# EAGLE design RPi_Extension_psu (EAGLE 7.6.0)
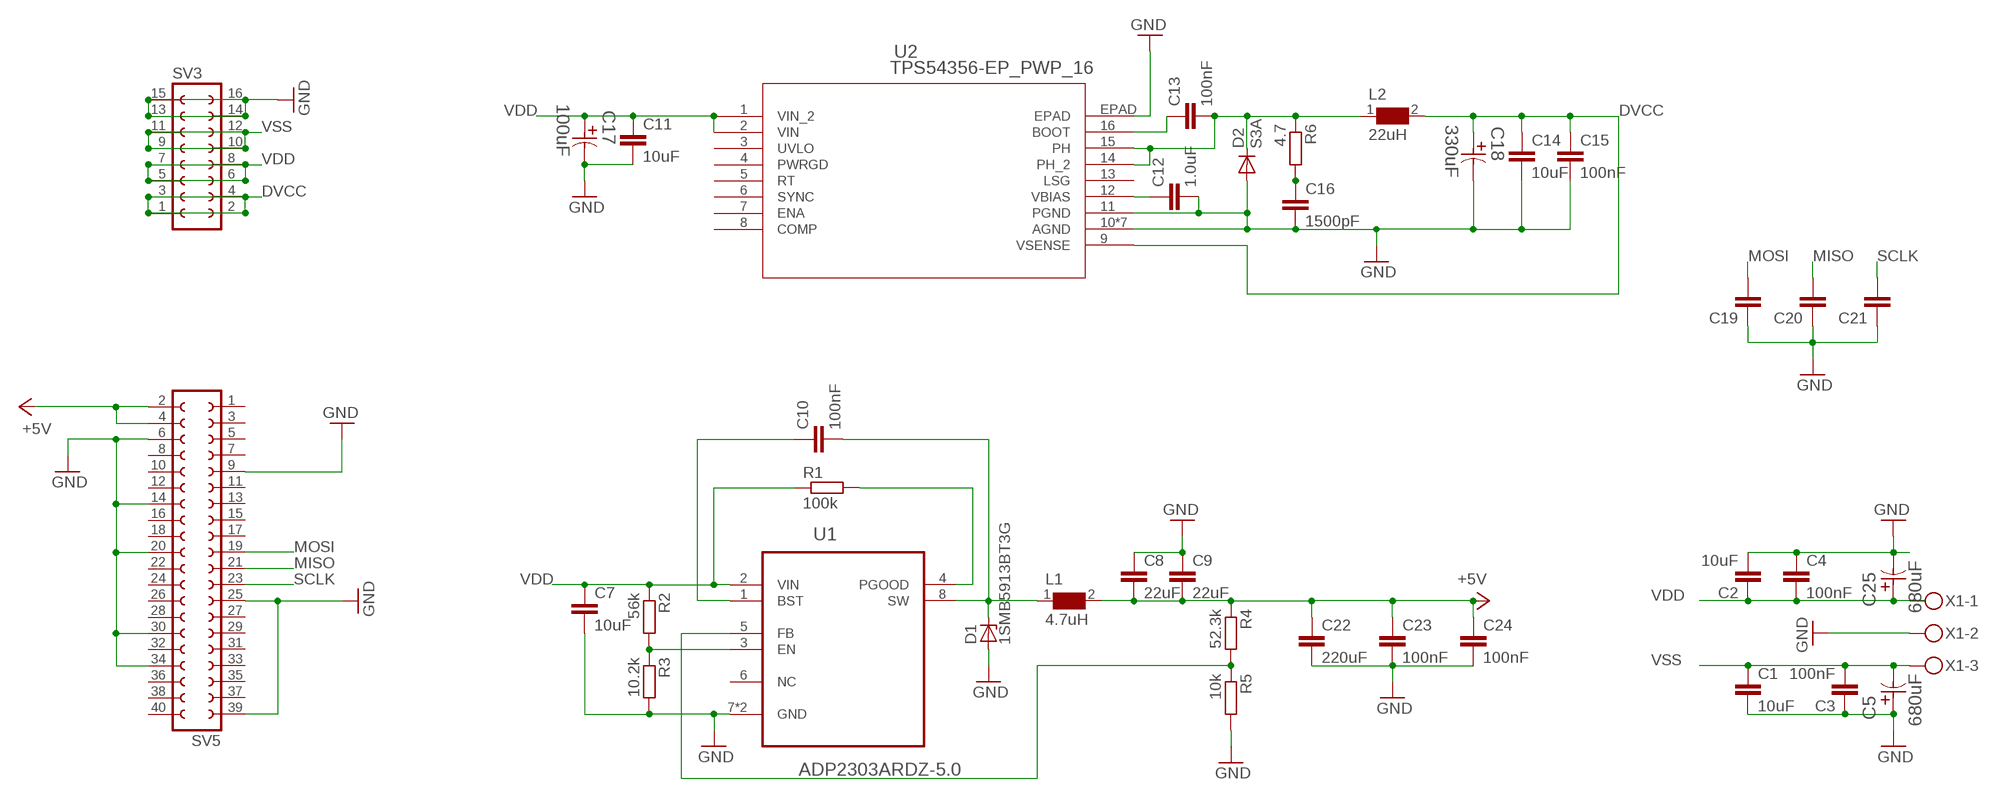
[diagram p0: schematic, sheet 1]

## Parts
C1  10uF  C-EUC1206  [C1206]
C2  10uF  C-EUC1206  [C1206]
C3  100nF  C-EUC0603  [C0603]
C4  100nF  C-EUC0603  [C0603]
C5  680uF  EEE-FT1C681AP-CASE-F  [CAPAE830X1050N]
C7  10uF  C-EUC0603  [C0603]
C8  22uF  C-EUC0603  [C0603]
C9  22uF  C-EUC0603  [C0603]
C10  100nF  C-EUC0603  [C0603]
C11  10uF  C-EUC0603  [C0603]
C12  1.0uF  C-EUC0603  [C0603]
C13  100nF  C-EUC0603  [C0603]
C14  10uF  C-EUC0603  [C0603]
C15  100nF  C-EUC0603  [C0603]
C16  1500pF  C-EUC0603  [C0603]
C17  100uF  EEE-FK1V101XP-CASE-D8  [CAPAE660X800N]
C18  330uF  EEE-FK1V331P-CASE-G  [CAPAE1030X1050N]
C19  C-EUC0603  [C0603]
C20  C-EUC0603  [C0603]
C21  C-EUC0603  [C0603]
C22  220uF  C-EUC1206  [C1206]
C23  100nF  C-EUC0603  [C0603]
C24  100nF  C-EUC0603  [C0603]
C25  680uF  EEE-FT1C681AP-CASE-F  [CAPAE830X1050N]
D1  1SMB5913BT3G  [DO214AA]
D2  S3A  [DO214AB]
L1  4.7uH  WE-PD-7447713047_1030/1050  [WE-PD_1030/1050]
L2  22uH  WE-PD-744770122_1260/1245/1280/1210  [WE-PD_1260/1245/1280/1210]
R1  100k  R-EU_R0603  [R0603]
R2  56k  R-EU_R0603  [R0603]
R3  10.2k  R-EU_R0603  [R0603]
R4  52.3k  R-EU_R0603  [R0603]
R5  10k  R-EU_R0603  [R0603]
R6  4.7  R-EU_R0603  [R0603]
SV3  FE08-2  [FE08-2]
SV5  FE20-2  [FE20-2]
U1  ADP2303ARDZ-5.0  [SOIC127P600X175-9N]
U2  TPS54356-EP_PWP_16  [PWP16_2P31X2P46]
X1  MKDSN1,5/3-5,08  [MKDSN1,5/3-5,08]

## Nets
+5V: C8.2 C9.2 C22.1 C23.1 C24.1 L1.2 R4.1 SV5.2 SV5.4
DVCC: C14.1 C15.1 C18.1 L2.2 SV3.1 SV3.2 SV3.3 SV3.4 U2.9(VSENSE)
GND: C1.2 C2.2 C3.1 C4.1 C5.1 C7.2 C8.1 C9.1 C11.2 C12.2 C14.2 C15.2 C16.2 C17.2 C18.2 C19.1 C20.1 C21.1 C22.2 C23.2 C24.2 C25.2 D1.A D2.A R3.2 R5.2 SV3.13 SV3.14 SV3.15 SV3.16 SV5.6 SV5.9 SV5.14 SV5.20 SV5.25 SV5.30 SV5.34 SV5.39 U1.7(GND) U1.9(GND) U2.10(AGND) U2.11(PGND) U2.EPAD U2.V(AGND) U2.V_1(AGND) U2.V_2(AGND) U2.V_3(AGND) U2.V_4(AGND) U2.V_5(AGND) X1.2
MISO: C20.2 SV5.21
MOSI: C19.2 SV5.19
N$1: R1.2 U1.4(PGOOD)
N$2: C10.1 U1.1(BST)
N$3: R2.2 R3.1 U1.3(EN)
N$4: C10.2 D1.C L1.1 U1.8(SW)
N$5: R4.2 R5.1 U1.5(FB)
N$6: C13.1 U2.16(BOOT)
N$7: C12.1 U2.12(VBIAS)
N$9: C16.1 R6.2
SCLK: C21.2 SV5.23
VDD: C2.1 C4.2 C7.1 C11.1 C17.1 C25.1 R1.1 R2.1 SV3.5 SV3.6 SV3.7 SV3.8 U1.2(VIN) U2.1(VIN_2) U2.2(VIN) X1.1
VOUT: C13.2 D2.C L2.1 R6.1 U2.14(PH_2) U2.15(PH)
VSS: C1.1 C3.2 C5.2 SV3.9 SV3.10 SV3.11 SV3.12 X1.3
Unconnected: SV5.1 SV5.3 SV5.5 SV5.7 SV5.8 SV5.10 SV5.11 SV5.12 SV5.13 SV5.15 SV5.16 SV5.17 SV5.18 SV5.22 SV5.24 SV5.26 SV5.27 SV5.28 SV5.29 SV5.31 SV5.32 SV5.33 SV5.35 SV5.36 SV5.37 SV5.38 SV5.40 U1.6(NC) U2.3(UVLO) U2.5(RT) U2.6(SYNC) U2.7(ENA) U2.8(COMP) U2.13(LSG)

## Power pins joined to a net without a drawn wire
PWRGD: U2.4(PWRGD)

## Library data of the parts
C1-C4 C7-C16 C19-C21 C23 C24 = rcl:C-EU: CAPACITOR, European symbol
C5 C25 = Panasonic-EEEFT_EEEH:EEE-: Aluminum Electrolytic Capacitors,Surface Mount Type; MPN: EEE-FT1C681AP; OC_FARNELL: 2065973; OC_NEWARK: 73T9162; PACKAGE: CASE-F; SUPPLIER: PANASONIC; TOLERANCE: ±20 %; VALUE: 680UF; VOLTAGERATING: 16V
C17 = Panasonic-EEEFK_EEEFP:EEE-: Aluminum Electrolytic Capacitors,Surface Mount Type; MPN: EEE-FK1V101XP; OC_FARNELL: 1850114; OC_NEWARK: 23T0869; PACKAGE: CASE-D8; SUPPLIER: PANASONIC; TOLERANCE: ±20 %; VALUE: 100UF; VOLTAGERATING: 35V
C18 = Panasonic-EEEFK_EEEFP:EEE-: Aluminum Electrolytic Capacitors,Surface Mount Type; MPN: EEE-FK1V331P; OC_FARNELL: 9695885; OC_NEWARK: 80K7175; PACKAGE: CASE-G; SUPPLIER: PANASONIC; TOLERANCE: ±20 %; VALUE: 330UF; VOLTAGERATING: 35V
C22 = resistor:C-EU: CAPACITOR, European symbol
D1 = 1smb59xx_10:1SMB59*BT3G: 1SMB59xxBT3G Series 3 Watt Plastic Surface Mount Zener Voltage Regulators Source: http://www.onsemi.com/pub_link/Collateral/1SMB5913BT3-D.PDF; MF: ON Semiconductor; MPN: 1SMB5913BT3G; OC_FARNELL: 1431155; OC_NEWARK: 88H5165
D2 = s3x_10:S3*: S3A - S3N General Purpose Rectifiers Source: http://www.fairchildsemi.com/datasheets/S3/S3A.pdf; MF: Fairchild; MPN: S3A; OC_FARNELL: 1017803; OC_NEWARK: 58K2395
L1 = WE-PD:WE-PD: SMD-Shielded Power Inductors WE-PD - Magnetically shielded version which results in a low leakage field - High storage capacity - Low self-losses - Highest possible current loading for SMD-Inducors -- Switching regulators with low operating voltages (computer, laptop, mobile phones, pagers) -- Integrated DC/DC-converter -- Is recommended for the application with switching regulators from National Semiconductor, Linear Technology, Texas Instruments and Fairchild Semiconductor, ect. -- Graphic cards -- Plastic base: Because of the one piece construction these are more suitable for high vibration or shock applications; MPN: 7447713047; OC_FARNELL: 2082661; OC_NEWARK: 88T7091; PACKAGE: 1030; SUPPLIER: Wuerth Elektronik
L2 = WE-PD:WE-PD: SMD-Shielded Power Inductors WE-PD - Magnetically shielded version which results in a low leakage field - High storage capacity - Low self-losses - Highest possible current loading for SMD-Inducors -- Switching regulators with low operating voltages (computer, laptop, mobile phones, pagers) -- Integrated DC/DC-converter -- Is recommended for the application with switching regulators from National Semiconductor, Linear Technology, Texas Instruments and Fairchild Semiconductor, ect. -- Graphic cards -- Plastic base: Because of the one piece construction these are more suitable for high vibration or shock applications; MPN: 744770122; OC_FARNELL: 1635927; OC_NEWARK: 08P2756; PACKAGE: 1280; SUPPLIER: Wuerth Elektronik
R1-R6 = rcl:R-EU_: RESISTOR, European symbol
SV3 = con-lsta:FE08-2: FEMALE HEADER; OC_FARNELL: unknown; OC_NEWARK: unknown
SV5 = con-lsta:FE20-2: FEMALE HEADER; OC_FARNELL: unknown; OC_NEWARK: unknown
U1 = ADP2303ARDZ:ADP2303ARDZ-5.0: Step-Down Regulators; MPN: ADP2303ARDZ-5.0; OC_FARNELL: 1843645; OC_NEWARK: 12T1264; PACKAGE: SOIC-8; SUPPLIER: Analog Devices
U2 = TPS54356:TPS54356-EP_PWP_16; DATASHEETURL: http://www.ti.com/lit/gpn/TPS54356-EP; DESCRIPTION: Enhanced Product 4.5-V To 20-V Input, 3-A Output Synchronous Pwm Switches W/ Integrated Fet; FAMILY_NAME: STEP-DOWN REGULATOR; GENERIC_PART_NUMBER: TPS54356-EP; INDUSTRY_STD_PKG_TYPE: HTSSOP; MANUFACTURER: Texas Instruments; MANUFACTURER_PART_NUMBER: tps54356-ep_pwp_16; PACKAGE_DESIGNATOR: PWP; PIN_COUNT: 16; VENDOR: Texas Instruments
X1 = con-phoenix-508:MKDSN1,5/3-5,08: MKDSN 1,5/ 3-5,08 Printklemme Nennstrom: 13,5 A Nennspannung: 250 V Rastermaß: 5,08 mm Polzahl: 3 Anschlussart: Schraubanschluss Montage: Löten Anschlussrichtung Leiter/Platine: 0 ° Artikelnummer: 1729131 Source: http://eshop.phoenixcontact.com .. 1729131.pdf

## Board
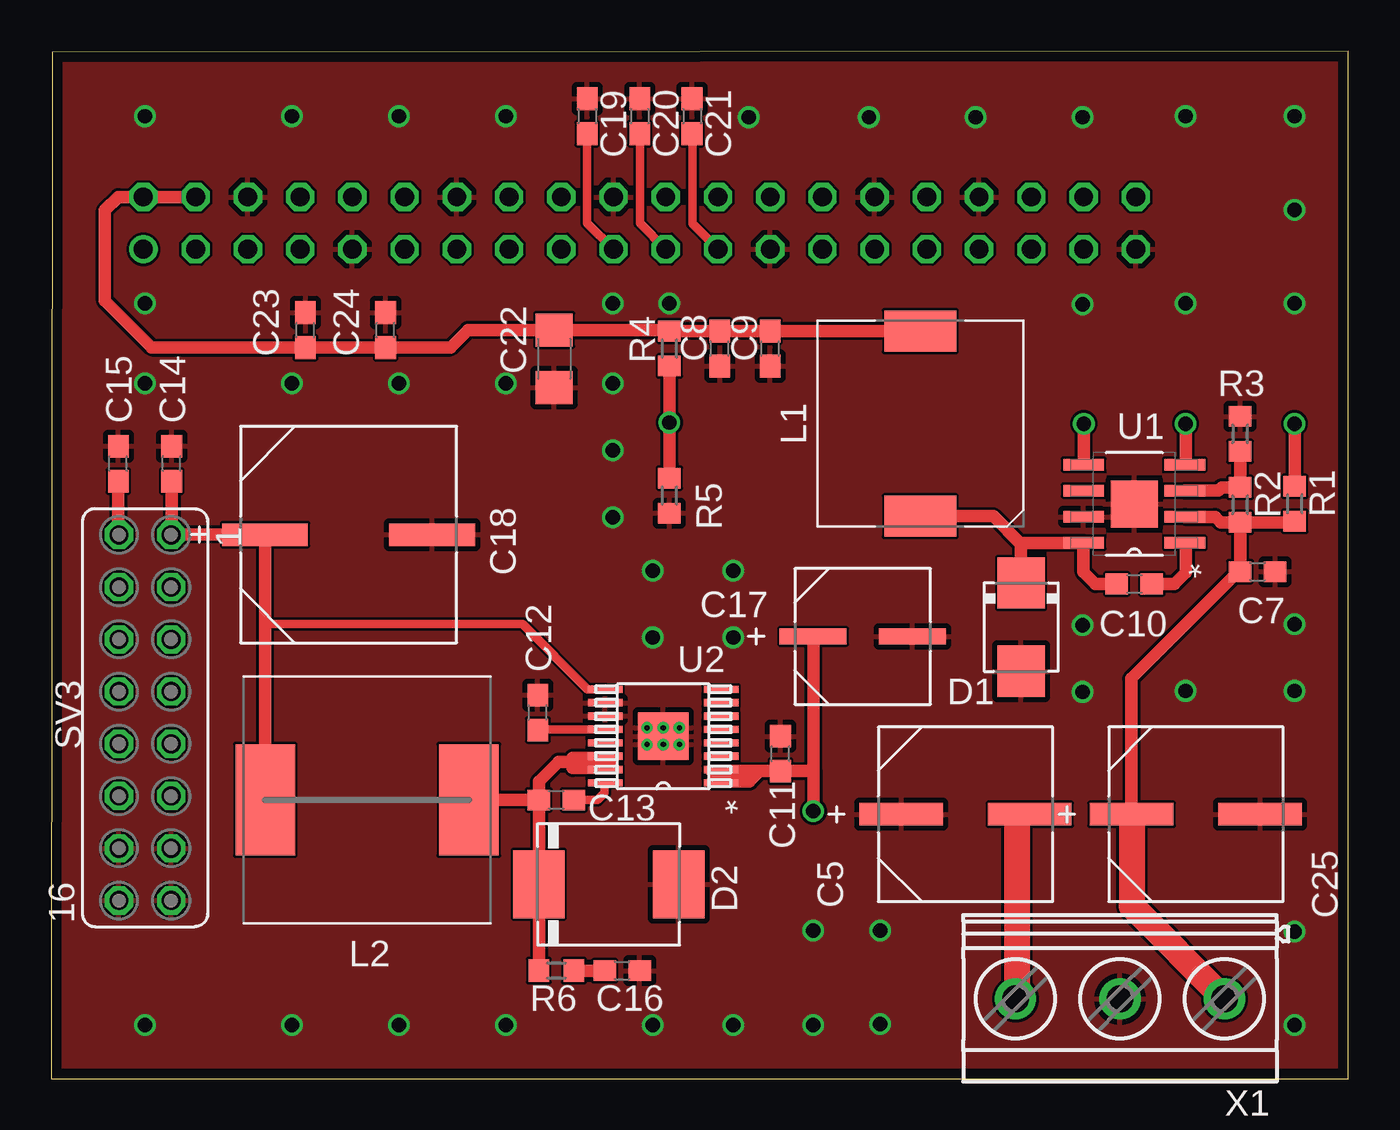
[diagram p1: board, top side]
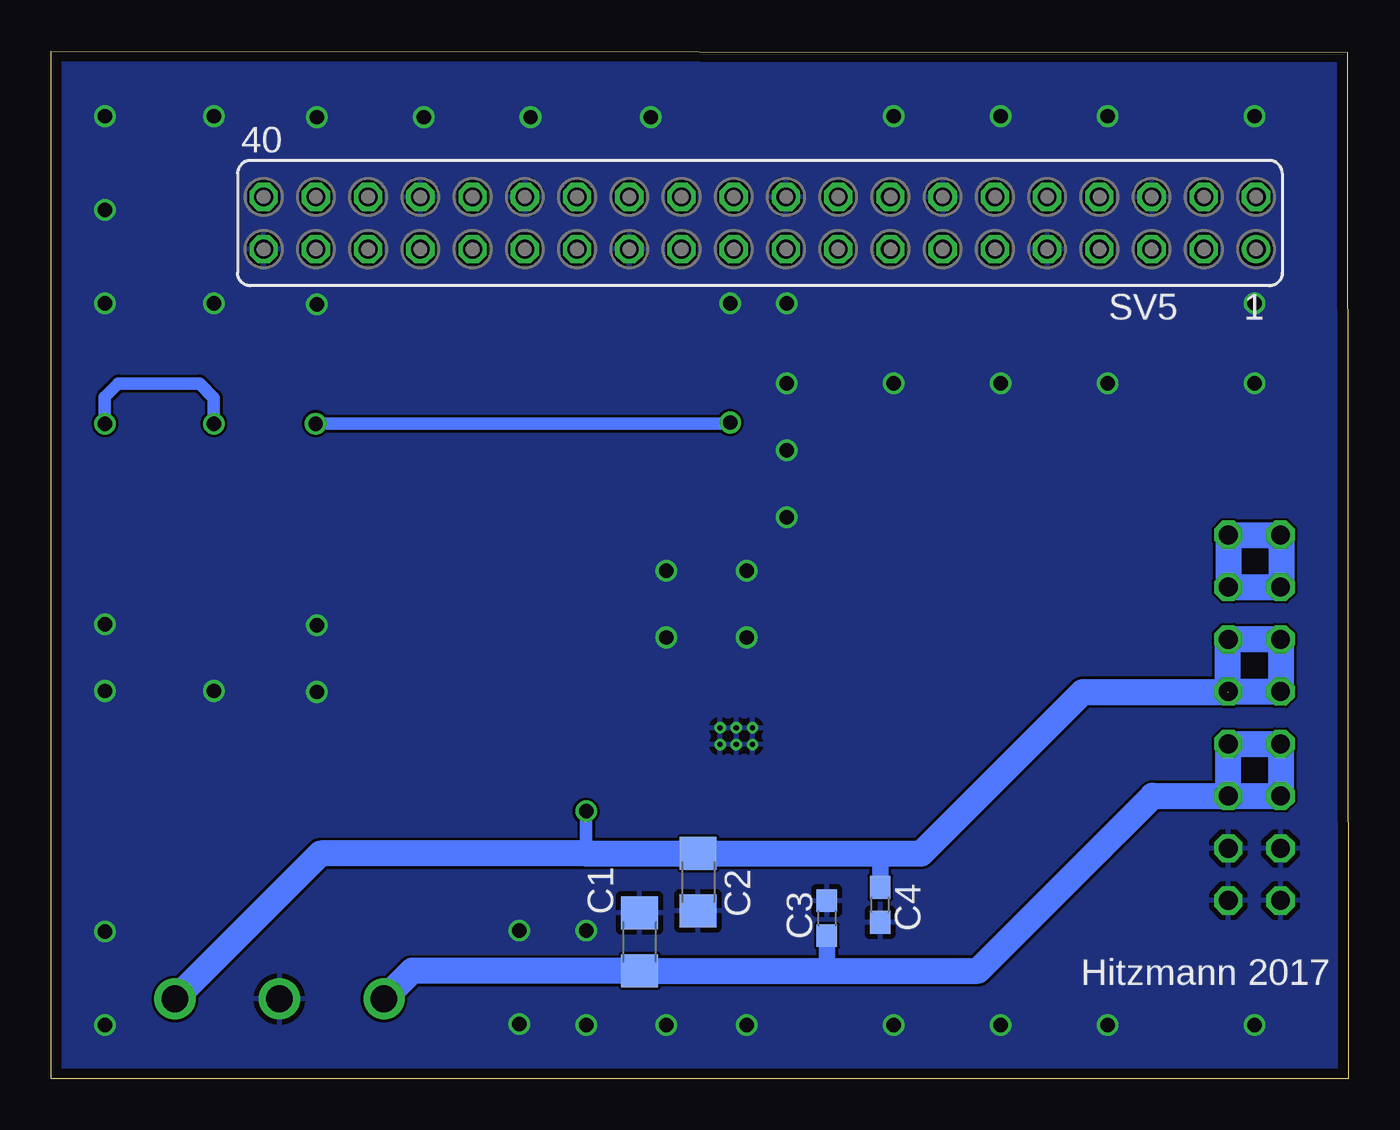
[diagram p2: board, bottom side, seen from below]

Size 63.05 x 49.95 mm. Coordinates in mm from the lower left corner, seen from the top.
Outline: 0,0 63.05,0 63.05,49.95 0.05,49.9 0,0
Copper layers (1*16): Top 0.035mm / dielectric 1.53mm / Bottom 0.035mm
Design rules "pban_5mil-l2": minimum track width 5mil, minimum drill 0.3mm, track to track 5mil, track to pad 0.229mm, pad to pad 5mil, via to via 5mil, smd to smd 5mil, copper to edge 0.5mm, drill to drill 0.5mm, minimum pad ring 0.15mm, minimum via ring 0.15mm, stop-mask expansion 4mil, vias tented up to drill 0.35mm, thermal gap 10mil

### Footprints (pad centres in the part's own frame; a part is rotated, then mirrored left to right if it is on the bottom)
C1206 = smd 1.6 x 1.8: 1 -1.4,0; 2 1.4,0
C0603 = smd 1.1 x 1: 1 -0.85,0; 2 0.85,0
CAPAE830X1050N = smd 4.064 x 1.092: 1 -3.124,0; 2 3.124,0
CAPAE660X800N = smd 3.251 x 0.762: 1 -2.413,0; 2 2.413,0
CAPAE1030X1050N = smd 4.166 x 1.092: 1 -4.064,0; 2 4.064,0
DO214AA = smd 2.5 x 2.3: A 2.15,0; C -2.15,0
DO214AB = smd 2.5 x 3.3: A 3.4,0; C -3.4,0
WE-PD_1030/1050 = smd 2 x 3.5: 1 -4.5,0; 2 4.5,0
WE-PD_1260/1245/1280/1210 = smd 2.9 x 5.4: 1 -4.95,0; 2 4.95,0
R0603 = smd 1 x 1.1: 1 -0.85,0; 2 0.85,0
FE08-2 = drill 0.914 octagon: 1 -8.89,1.27; 2 -8.89,-1.27; 3 -6.35,1.27; 4 -6.35,-1.27; 5 -3.81,1.27; 6 -3.81,-1.27; 7 -1.27,1.27; 8 -1.27,-1.27; 9 1.27,1.27; 10 1.27,-1.27; 11 3.81,1.27; 12 3.81,-1.27; 13 6.35,1.27; 14 6.35,-1.27; 15 8.89,1.27; 16 8.89,-1.27
FE20-2 = drill 0.914: 1 -24.13,1.27 | drill 0.914 octagon: 2 -24.13,-1.27; 3 -21.59,1.27; 4 -21.59,-1.27; 5 -19.05,1.27; 6 -19.05,-1.27; 7 -16.51,1.27; 8 -16.51,-1.27; 9 -13.97,1.27; 10 -13.97,-1.27; 11 -11.43,1.27; 12 -11.43,-1.27; 13 -8.89,1.27; 14 -8.89,-1.27; 15 -6.35,1.27; 16 -6.35,-1.27; 17 -3.81,1.27; 18 -3.81,-1.27; 19 -1.27,1.27; 20 -1.27,-1.27; 21 1.27,1.27; 22 1.27,-1.27; 23 3.81,1.27; 24 3.81,-1.27; 25 6.35,1.27; 26 6.35,-1.27; 27 8.89,1.27; 28 8.89,-1.27; 29 11.43,1.27; 30 11.43,-1.27; 31 13.97,1.27; 32 13.97,-1.27; 33 16.51,1.27; 34 16.51,-1.27; 35 19.05,1.27; 36 19.05,-1.27; 37 21.59,1.27; 38 21.59,-1.27; 39 24.13,1.27; 40 24.13,-1.27
SOIC127P600X175-9N = smd 1.981 x 0.559: 1 -2.464,1.905; 2 -2.464,0.635; 3 -2.464,-0.635; 4 -2.464,-1.905; 5 2.464,-1.905; 6 2.464,-0.635; 7 2.464,0.635; 8 2.464,1.905 | smd 2.286 x 2.286: 9 0,0
PWP16_2P31X2P46 = smd 1.676 x 0.356: 1 -2.819,2.275; 2 -2.819,1.625; 3 -2.819,0.975; 4 -2.819,0.325; 5 -2.819,-0.325; 6 -2.819,-0.975; 7 -2.819,-1.625; 8 -2.819,-2.275; 9 2.819,-2.275; 10 2.819,-1.625; 11 2.819,-0.975; 12 2.819,-0.325; 13 2.819,0.325; 14 2.819,0.975; 15 2.819,1.625; 16 2.819,2.275 | smd 2.46 x 2.31: EPAD 0,0 | drill 0.254 pad 0.508: V -0.787,-0.406; V_1 -0.787,0.406; V_2 0,-0.406; V_3 0,0.406; V_4 0.787,-0.406; V_5 0.787,0.406
MKDSN1,5/3-5,08 = drill 1.3 pad 2: 1 -7.641,0.025; 2 -2.561,0.025; 3 2.519,0.025

### Placement (x,y rotation side)
C1  34.45,6.65 90 bottom
C2  31.6,9.55 270 bottom
C3  25.35,7.8 270 bottom
C4  22.75,8.45 90 bottom
C5  44.45,12.85 0 top
C7  58.65,24.65 0 top
C8  47uF  [C0603]  32.5,35.5 90 top
C9  100nF  [C0603]  34.95,35.5 90 top
C10  52.65,24.05 180 top
C11  35.45,15.8 90 top
C12  23.65,17.8 90 top
C13  24.55,13.55 180 top
C14  5.85,29.9 90 top
C15  3.25,29.9 90 top
C16  27.75,5.25 0 top
C17  39.45,21.5 0 top
C18  14.45,26.45 0 top
C19  26.05,46.8 270 top
C20  28.6,46.8 270 top
C21  31.15,46.8 270 top
C22  24.45,35 270 top
C23  12.35,36.4 90 top
C24  16.25,36.4 90 top
C25  55.65,12.85 0 top
D1  47.15,21.95 270 top
D2  27.1,9.45 0 top
L1  42.25,31.85 90 top
L2  15.35,13.55 180 top
R1  60.45,27.95 90 top
R2  57.8,27.9 90 top
R3  57.8,31.35 90 top
R4  30.05,35.5 270 top
R5  30.05,28.35 270 top
R6  24.55,5.25 0 top
SV3  4.55,17.55 270 top
SV5  28.6,41.6 180 bottom
U1  52.65,27.95 180 top
U2  29.75,16.65 180 top
X1  MKDSN1,5/3-5,08  [MKDSN1,5/3-5,08]  49.4,3.9 180 top

### Tracks (layer width: path | path; a pad name or v marks a point on that pad's centre or on a via)
+5V
  Top 0.61: SV5.4 SV5.2 3.25,42.87 2.6,42.22 2.6,37.83 4.88,35.55 C23.1 C24.1 19.4,35.55 20.25,36.4 C22.1 30,36.4 R4.1 | L1.2 C9.2 C8.2 R4.1 | R4.1 29.95,36.35 29.9,36.4
DVCC
  Top 0.406: 10.4,22.1 22.9,22.1 26.07,18.93 U2.9
  Top 0.61: L2.2 10.4,22.1 10.4,26.44 C18.1 SV3.1 5.85,26.47 C14.1 | C15.1 3.25,26.47 SV3.2
  Bottom 0.406: SV3.2 SV3.1
  Bottom 1.27: SV3.4 SV3.3 SV3.1 3.25,26.44 3.25,24.05
GND  (via drill 0.7)
  other vias: 30.05,37.7 4.55,37.7 4.55,33.8 37.05,7.2 29.25,2.6 37.05,2.6 55.15,37.7 55.15,18.85 60.45,37.7 60.45,2.6 11.7,2.6 4.55,46.8 55.15,46.8 60.45,46.8 60.45,18.85 27.3,30.55 27.3,27.3 27.3,33.8 50.15,37.65 50.15,18.8 50.15,22.05 60.45,22.1 16.9,2.6 11.7,46.8 50.15,46.75 44.95,46.75 39.75,46.75 16.9,46.8 22.1,46.8 60.45,42.25 27.3,37.7 29.25,24.7 29.25,21.45 11.7,33.8 16.9,33.8 22.1,33.8 60.45,7.15 4.55,2.6 22.1,2.6 33.15,24.7 33.15,21.45 33.9,46.75 40.3,7.2 40.3,2.65 33.15,2.6
  pour Top: -0.65,-0.65 63.7,-0.65 63.7,50.7 -0.65,50.7
  pour Bottom: 0,0 0,50.05 63.05,50.05 63.05,0
MISO
  Top 0.406: SV5.21 28.61,41.59 28.61,45.94 C20.2
MOSI
  Top 0.406: SV5.19 26.05,41.61 C19.2
N$1  (via drill 0.7)
  Top 0.406: U1.4 55.11,30.06 55.15,30.1
  Top 0.61: R1.2 v60.45,31.85 | 55.15,30.1 v55.15,31.85
  Bottom 0.61: v60.45,31.85 60.45,33.15 59.8,33.8 55.85,33.8 55.15,33.1 v55.15,31.85
N$2
  Top 0.406: U1.1 55.11,25.99 55.15,25.95
  Top 0.61: C10.1 54.6,24.05 55.15,24.6 55.15,25.95
N$3
  Top 0.61: R3.1 R2.2 56.9,28.75 56.73,28.59 U1.3
N$4
  Top 0.61: C10.2 50.77,24.05 50.19,24.63 U1.8 47.2,26.05 47.15,26 | 46.4,23.55 D1.C 47.15,26 | L1.1 45.8,27.35 47.15,26
N$5  (via drill 0.7)
  Top 0.406: U1.5 50.19,30.04 50.2,30.05
  Top 0.61: R5.1 30.05,29.86 v30.05,31.89 v30.05,31.9 R4.2 | 50.2,30.05 v50.2,31.85
  Bottom 0.61: v50.2,31.85 30.1,31.85 v30.05,31.9
N$6
  Top 0.254: U2.16 26.93,14.28 26.9,14.25
  Top 0.406: 26.9,14.25 26.9,13.9 26.55,13.55 C13.1
N$7
  Top 0.406: U2.12 24.02,16.98 C12.1
N$9
  Top 0.61: R6.2 C16.1
SCLK
  Top 0.406: SV5.23 31.16,41.58 31.16,45.94 C21.2
VDD  (via drill 0.7)  (1 unrouted)
  Top 0.254: U2.1 32.23,14.38 32.15,14.45 | U2.2 32.17,15.03 32.1,14.95
  Top 0.61: U1.2 56.59,27.32 56.85,27.05 R2.1 | R2.1 C7.1 57.7,24.65 52.5,19.45 52.5,12.88 C25.1 | R2.1 60.4,27.05 R1.1 | 32.15,14.45 33.95,14.45 34.45,14.95 | 32.1,14.95 34.45,14.95 | 34.45,14.95 C11.1 37,14.95 37.05,15 | 37.05,15 v37.05,13 | 37.05,15 37.05,21.49 C17.1
  Top 1.27: C25.1 52.53,8.39 X1.1
  Bottom 0.61: v37.05,13 37.05,10.95
  Bottom 0.813: C4.2 22.75,10.95
  Bottom 1.27: 3.25,21.36 SV3.6 | SV3.6 SV3.8 SV3.7 5.84,18.8 12.9,18.8 20.75,10.95 22.75,10.95 C2.1 37.05,10.95 49.97,10.95 X1.1 | SV3.6 SV3.5 | 5.84,18.78 5.84,21.32
VOUT
  Top 0.254: U2.14 27.3,15.68 27.3,15.6 | U2.15 27.3,15.03 27.3,15.1
  Top 0.61: C13.2 L2.1 | 27.3,15.6 25.35,15.6 25.35,15.4 | 27.3,15.1 25.35,15.1 25.35,15.4 | C13.2 23.7,14.45 24.65,15.4 25.35,15.4 | C13.2 D2.C R6.1
VSS
  Top 0.406: 5.82,16.3 SV3.9 | 47.35,12.8 46.95,12.8 46.95,12.6
  Top 0.61: C5.2 47.57,12.88 47.45,13 47.45,12.9 47.35,12.8
  Top 1.27: 46.95,12.6 46.95,3.94 X1.3
  Bottom 0.406: SV3.9 5.85,16.28 | 5.82,13.65 SV3.11
  Bottom 0.813: C3.2 25.35,5.25
  Bottom 1.27: SV3.9 SV3.10 SV3.12 SV3.11 9.5,13.75 18,5.25 25.35,5.25 C1.1 45.51,5.25 X1.3 | 5.85,16.28 5.85,13.75

### Text on the board
bNames: Hitzmann 2017